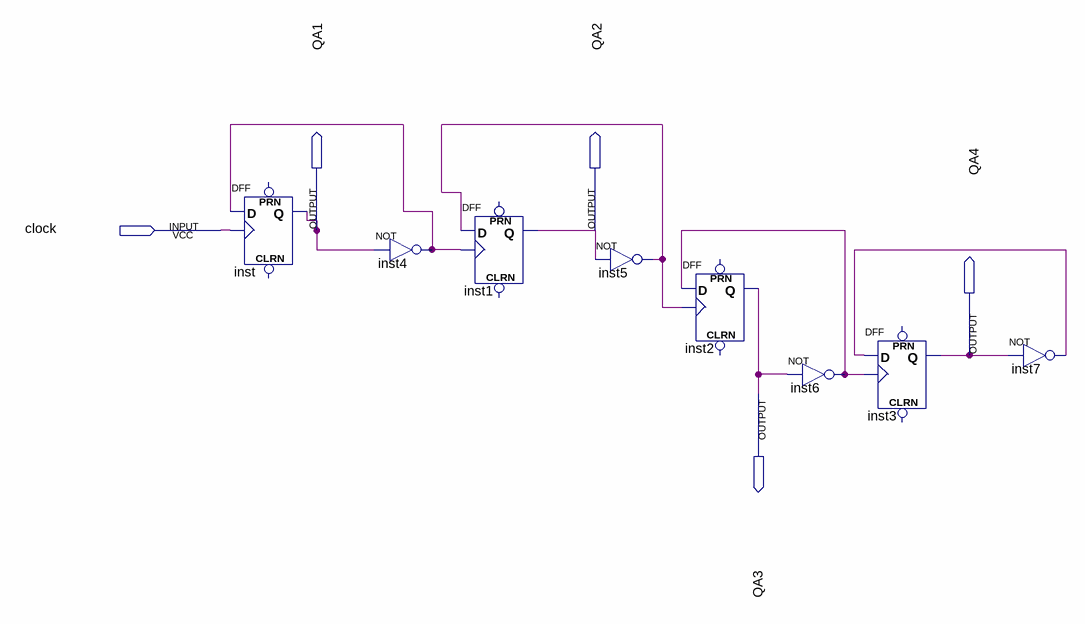
[diagram p0: schematic sheet]
// Quartus schematic 4-BIT-COUNT.bdf as structural Verilog: 8 symbols, 5 pins
module \4-BIT-COUNT  (
  input  clock,
  output QA1,
  output QA2,
  output QA4,
  output QA3
);

  wire inst4_out, inst5_out, inst6_out, inst7_out;

  DFF inst (.CLK(clock), .D(inst4_out), .Q(QA1));  // open: CLRN, PRN
  not inst4 (inst4_out, QA1);
  DFF inst1 (.CLK(inst4_out), .D(inst5_out), .Q(QA2));  // open: CLRN, PRN
  not inst5 (inst5_out, QA2);
  DFF inst2 (.CLK(inst5_out), .D(inst6_out), .Q(QA3));  // open: CLRN, PRN
  not inst6 (inst6_out, QA3);
  DFF inst3 (.CLK(inst6_out), .D(inst7_out), .Q(QA4));  // open: CLRN, PRN
  not inst7 (inst7_out, QA4);
endmodule
